# Altium project Remotev02.PrjPcb
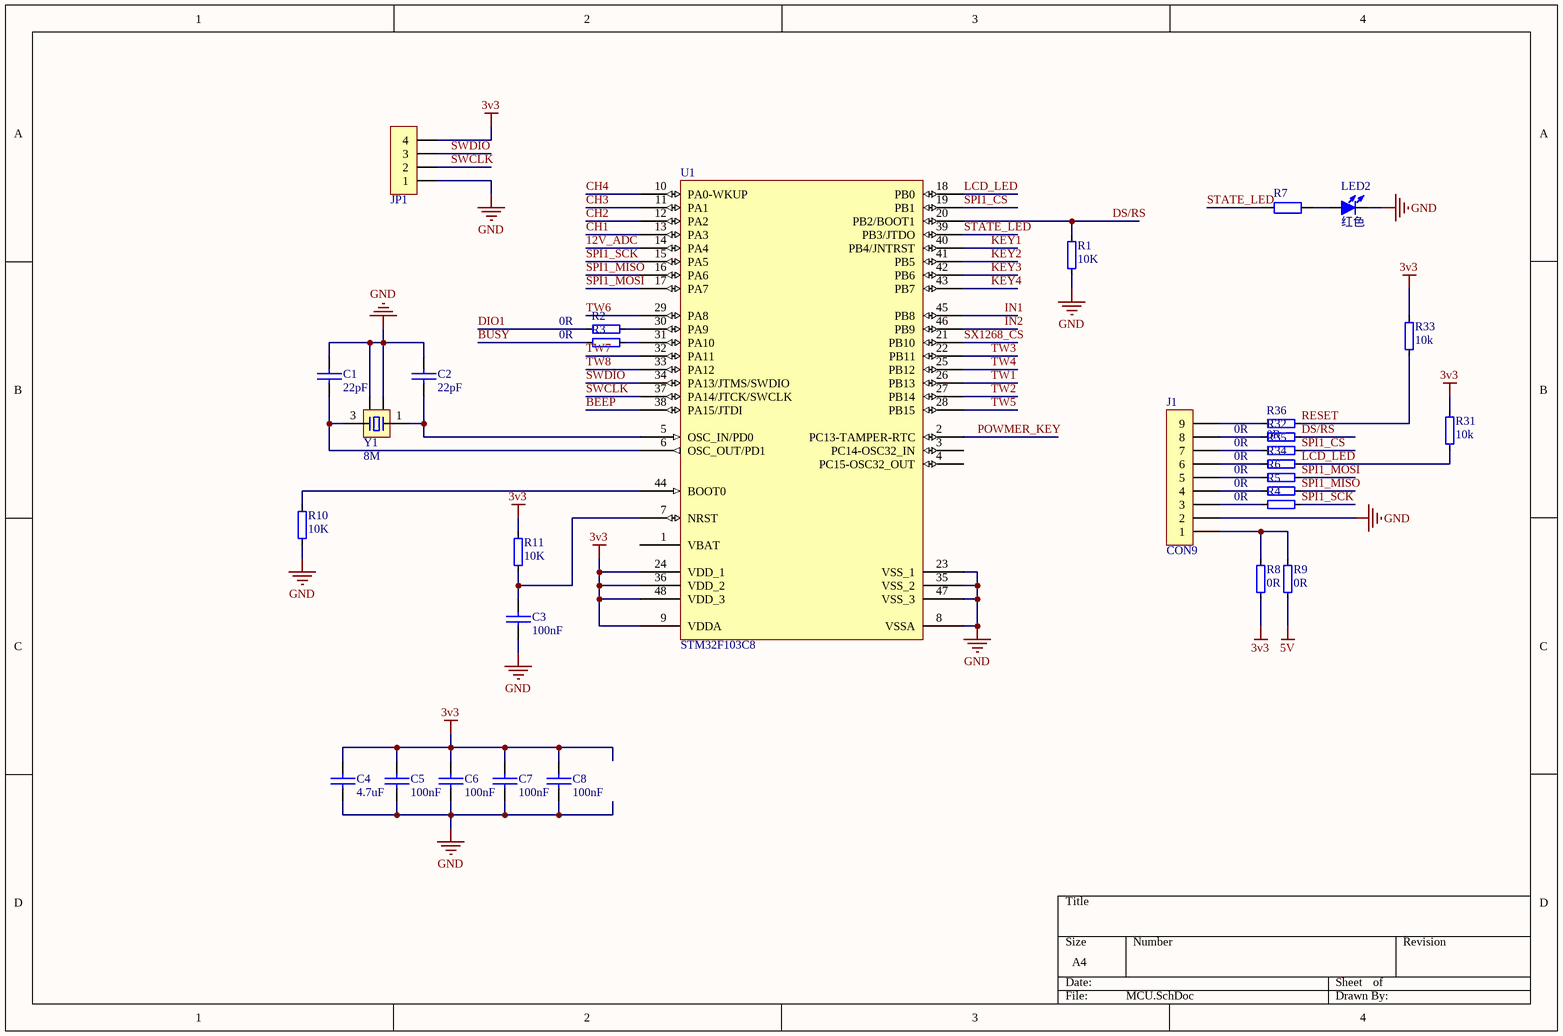
[diagram p0: MCU.SchDoc]
3 sheets, 116 parts. Net scope: global (net labels, ports and power ports of the same name join across sheets).
Board file: Remote.PcbDoc
Sheets:
  MCU.SchDoc
  INPUT.SchDoc
  COMMUNICATION.SchDoc

## Sheet MCU.SchDoc
size A4; SheetNumber: 1; SheetTotal: 4

### Parts
(Parts that share a designator on the sheet are numbered #1, #2 ... from top to bottom, then left to right.)
C1  22pF  [C 0603_L]
C2  22pF  [C 0603_L]
C3  100nF  [C 0603_L]
C4  4.7uF  [C 0603_L]
C5  100nF  [C 0603_L]
C6  100nF  [C 0603_L]
C7  100nF  [C 0603_L]
C8  100nF  [C 0603_L]
J1  CON9  [HDR2.54-Y-LI-9P]
JP1  HDR-1X4  [HDR2.54-LI-4P]  (value not drawn)
LED2  红色  [LED 0805G]
R1  10K  [R 0603_L]
R2  0R  [R 0603_L]
R3  0R  [R 0603_L]
R4  0R  [R 0603_L]
R5  0R  [R 0603_L]
R6  0R  [R 0603_L]
R7  (no value)  [R 0603_L]
R8  0R  [R 0603_L]
R9  0R  [R 0603_L]
R10  10K  [R 0603_L]
R11  10K  [R 0603_L]
R31  10k  [R 0603_L]
R32  0R  [R 0603_L]
R33  10k  [R 0603_L]
R34#1  0R  [R 0603_L]
R35#1  0R  [R 0603_L]
R36#1  0R  [R 0603_L]
U1  STM32F103C8  [LQFP-48_M]
Y1  8M  [OSC 3225-4P]

### Nets
3v3: C4.1 C5.1 C6.1 C7.1 C8.1 JP1.4 R8.2 R11.2 R31.1 R33.1 U1.9(VDDA) U1.24(VDD_1) U1.36(VDD_2) U1.48(VDD_3)
5V: R9.2
GND: C1.1 C2.1 C3.2 C4.2 C5.2 C6.2 C7.2 C8.2 J1.2 JP1.1 LED2.2(K) R1.2 R10.1 U1.8(VSSA) U1.23(VSS_1) U1.35(VSS_2) U1.47(VSS_3) Y1.2 Y1.4
12V_ADC: U1.14(PA4)
BEEP: U1.38(PA15/JTDI)
BUSY: R3.2
CH1: U1.13(PA3)
CH2: U1.12(PA2)
CH3: U1.11(PA1)
CH4: U1.10(PA0-WKUP)
DIO1: R2.2
DS/RS: R1.1 R32.1 U1.20(PB2/BOOT1)
IN1: U1.45(PB8)
IN2: U1.46(PB9)
KEY1: U1.40(PB4/JNTRST)
KEY2: U1.41(PB5)
KEY3: U1.42(PB6)
KEY4: U1.43(PB7)
LCD_LED: R31.2 R34#1.1 U1.18(PB0)
POWMER_KEY: U1.2(PC13-TAMPER-RTC)
RESET: R33.2 R36#1.2
SPI1_CS: R35#1.1 U1.19(PB1)
SPI1_MISO: R5.1 U1.16(PA6)
SPI1_MOSI: R6.1 U1.17(PA7)
SPI1_SCK: R4.1 U1.15(PA5)
STATE_LED: R7.1 U1.39(PB3/JTDO)
SWCLK: JP1.2 U1.37(PA14/JTCK/SWCLK)
SWDIO: JP1.3 U1.34(PA13/JTMS/SWDIO)
SX1268_CS: U1.21(PB10)
TW1: U1.26(PB13)
TW2: U1.27(PB14)
TW3: U1.22(PB11)
TW4: U1.25(PB12)
TW5: U1.28(PB15)
TW6: U1.29(PA8)
TW7: U1.32(PA11)
TW8: U1.33(PA12)
NetC1_2: C1.2 U1.6(OSC_OUT/PD1) Y1.3
NetC2_2: C2.2 U1.5(OSC_IN/PD0) Y1.1
NetC3_1: C3.1 R11.1 U1.7(NRST)
NetJ1_1: J1.1 R8.1 R9.1
NetJ1_3: J1.3 R4.2
NetJ1_4: J1.4 R5.2
NetJ1_5: J1.5 R6.2
NetJ1_6: J1.6 R34#1.2
NetJ1_7: J1.7 R35#1.2
NetJ1_8: J1.8 R32.2
NetJ1_9: J1.9 R36#1.1
NetLED2_1: LED2.1(A) R7.2
NetR2_1: R2.1 U1.30(PA9)
NetR3_1: R3.1 U1.31(PA10)
NetR10_2: R10.2 U1.44(BOOT0)

Not connected (* = marked no-connect by the designer): U1 1(VBAT) 3(PC14-OSC32_IN) 4(PC15-OSC32_OUT)

### Library data of the parts
C1-C8 = 普通电容: Capacitor
J1 = CON9: Connector
JP1 = Header 4: 4P接插件; 版权归属: 源创客; BOM名称: 4P接插件; 学习资源: www.ooocke.com
LED2 = LED-SMD: 贴片LED; 版权归属: 源创客; BOM名称: 贴片LED; 学习资源: www.ooocke.com
R1-R6 R8-R11 R31-R33 R34#1 R35#1 R36#1 = 普通电阻
R7 = R: 贴片电阻; 版权归属: 源创客; BOM名称: 贴片电阻; 学习资源: www.ooocke.com
U1 = STM32F103C8: Flaah:64/RAM:20/IO:36; BOM名称: 32位STM单片机; 版权归属: 源创客; 学习资源: www.ooocke.com
Y1 = XTAL-4P: 4脚无源晶振; 版权归属: 源创客; BOM名称: 4脚无源晶振; 学习资源: www.ooocke.com

## Sheet INPUT.SchDoc
size A4; SheetNumber: 2; SheetTotal: 4
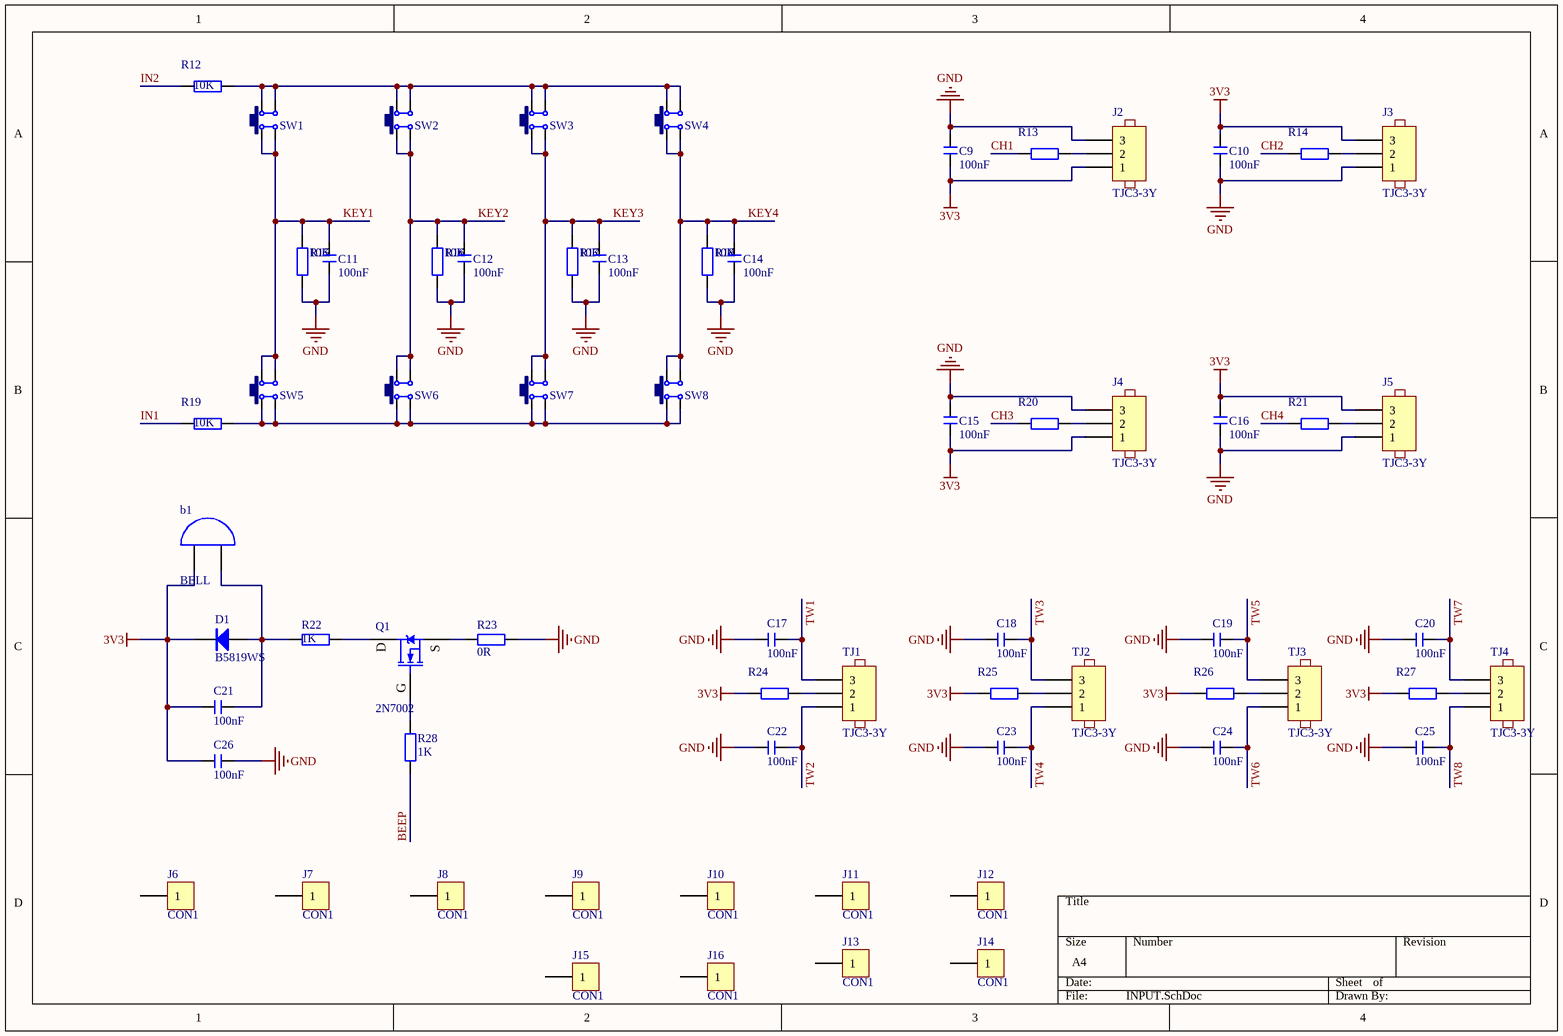
[diagram p1: INPUT.SchDoc]

### Parts
b1  BELL  [BEEP 5x9x5.5]
C9  100nF  [C 0603_L]
C10  100nF  [C 0603_L]
C11  100nF  [C 0603_L]
C12  100nF  [C 0603_L]
C13  100nF  [C 0603_L]
C14  100nF  [C 0603_L]
C15  100nF  [C 0603_L]
C16  100nF  [C 0603_L]
C17  100nF  [C 0603_L]
C18  100nF  [C 0603_L]
C19  100nF  [C 0603_L]
C20  100nF  [C 0603_L]
C21  100nF  [C 0603_L]
C22  100nF  [C 0603_L]
C23  100nF  [C 0603_L]
C24  100nF  [C 0603_L]
C25  100nF  [C 0603_L]
C26  100nF  [C 0603_L]
D1  B5819WS  [SOD-323]
J2  TJC3-3Y  [MX 1.25-LS-3P]
J3  TJC3-3Y  [MX 1.25-LS-3P]
J4  TJC3-3Y  [MX 1.25-LS-3P]
J5  TJC3-3Y  [MX 1.25-LS-3P]
J6  CON1  [M3x5+6_L]
J7  CON1  [M3x5+6_L]
J8  CON1  [M3x5+6_L]
J9  CON1  [M3x5+6_L]
J10  CON1  [M3x5+6_L]
J11  CON1  [M3x5+6_L]
J12  CON1  [M3x5+6_L]
J13  CON1  [M3x5+6_L]
J14  CON1  [M3x5+6_L]
J15  CON1  [M3x5+6_L]
J16  CON1  [M3x5+6_L]
Q1  2N7002  [SOT-23]
R12  10K  [R 0603_L]
R13  (no value)  [R 0603_L]
R14  (no value)  [R 0603_L]
R15  10K  [R 0603_L]
R16  10K  [R 0603_L]
R17  10K  [R 0603_L]
R18  10K  [R 0603_L]
R19  10K  [R 0603_L]
R20  (no value)  [R 0603_L]
R21  (no value)  [R 0603_L]
R22  1K  [R 0603_L]
R23  0R  [R 0603_L]
R24  (no value)  [R 0603_L]
R25  (no value)  [R 0603_L]
R26  (no value)  [R 0603_L]
R27  (no value)  [R 0603_L]
R28  1K  [R 0603_L]
SW1  6x6x5  [TSW SMD-6*6*5-L]  (value not drawn)
SW2  6x6x5  [TSW SMD-6*6*5-L]  (value not drawn)
SW3  6x6x5  [TSW SMD-6*6*5-L]  (value not drawn)
SW4  6x6x5  [TSW SMD-6*6*5-L]  (value not drawn)
SW5  6x6x5  [TSW SMD-6*6*5-L]  (value not drawn)
SW6  6x6x5  [TSW SMD-6*6*5-L]  (value not drawn)
SW7  6x6x5  [TSW SMD-6*6*5-L]  (value not drawn)
SW8  6x6x5  [TSW SMD-6*6*5-L]  (value not drawn)
TJ1  TJC3-3Y  [MX 1.25-LS-3P]
TJ2  TJC3-3Y  [MX 1.25-LS-3P]
TJ3  TJC3-3Y  [MX 1.25-LS-3P]
TJ4  TJC3-3Y  [MX 1.25-LS-3P]

### Nets
3v3: b1.1 C9.1 C10.2 C15.1 C16.2 C21.2 C26.2 D1.2(K) J2.1 J3.3 J4.1 J5.3 R24.2 R25.2 R26.2 R27.2
GND: C9.2 C10.1 C11.1 C12.1 C13.1 C14.1 C15.2 C16.1 C17.2 C18.2 C19.2 C20.2 C22.2 C23.2 C24.2 C25.2 C26.1 J2.3 J3.1 J4.3 J5.1 R15.2 R16.2 R17.2 R18.2 R23.1
BEEP: R28.1
CH1: R13.2
CH2: R14.2
CH3: R20.2
CH4: R21.2
IN1: R19.2
IN2: R12.2
KEY1: C11.2 R15.1 SW1.1 SW1.4 SW5.2 SW5.3
KEY2: C12.2 R16.1 SW2.1 SW2.4 SW6.2 SW6.3
KEY3: C13.2 R17.1 SW3.1 SW3.4 SW7.2 SW7.3
KEY4: C14.2 R18.1 SW4.1 SW4.4 SW8.2 SW8.3
TW1: C17.1 TJ1.3
TW2: C22.1 TJ1.1
TW3: C18.1 TJ2.3
TW4: C23.1 TJ2.1
TW5: C19.1 TJ3.3
TW6: C24.1 TJ3.1
TW7: C20.1 TJ4.3
TW8: C25.1 TJ4.1
Netb1_2: b1.2 C21.1 D1.1(A) R22.1
NetJ2_2: J2.2 R13.1
NetJ3_2: J3.2 R14.1
NetJ4_2: J4.2 R20.1
NetJ5_2: J5.2 R21.1
NetQ1_1: Q1.1(G) R28.2
NetQ1_2: Q1.2(D) R22.2
NetQ1_3: Q1.3(S) R23.2
NetR12_1: R12.1 SW1.2 SW1.3 SW2.2 SW2.3 SW3.2 SW3.3 SW4.2 SW4.3
NetR19_1: R19.1 SW5.1 SW5.4 SW6.1 SW6.4 SW7.1 SW7.4 SW8.1 SW8.4
NetR24_1: R24.1 TJ1.2
NetR25_1: R25.1 TJ2.2
NetR26_1: R26.1 TJ3.2
NetR27_1: R27.1 TJ4.2

Not connected (* = marked no-connect by the designer): J6 1; J7 1; J8 1; J9 1; J10 1; J11 1; J12 1; J13 1; J14 1; J15 1; J16 1

### Library data of the parts
C9-C26 = C: 无极性贴片电容; 版权归属: 源创客; BOM名称: 无极性贴片电容; 学习资源: www.ooocke.com
D1 = SR540: 肖特基二极管                           电压:40V 电流:1A                 C7420331; BOM名称: 整流二极管; 版权归属: 源创客; 属性: 40V  5A; 学习资源: www.ooocke.com
J2-J5 TJ1-TJ4 = TJC3-3Y: HCZZ0015-3             C7433469; Set Position: 0.5; Published: 8-Jun-2000; LatestRevisionDate: 17-Jul-2002; LatestRevisionNote: Re-released for DXP Platform.; PackageReference: AXIAL-0.6; Publisher: Altium Limited
Q1 = IRF840: N沟场效应管; pin to pad: 2>3 3>2; 版权归属: 源创客; BOM名称: N沟场效应管; 学习资源: www.ooocke.com
R12-R28 = R: 贴片电阻; 版权归属: 源创客; BOM名称: 贴片电阻; 学习资源: www.ooocke.com
SW1-SW8 = TSW SMD-6x6: KH-6X6X5H-STM     C2837531; pin to pad: 3>0 4>0; BOM名称: 贴片6x6轻触开关; 版权归属: 源创客; 学习资源: www.ooocke.com

## Sheet COMMUNICATION.SchDoc
size A4; SheetNumber: 3; SheetTotal: 4
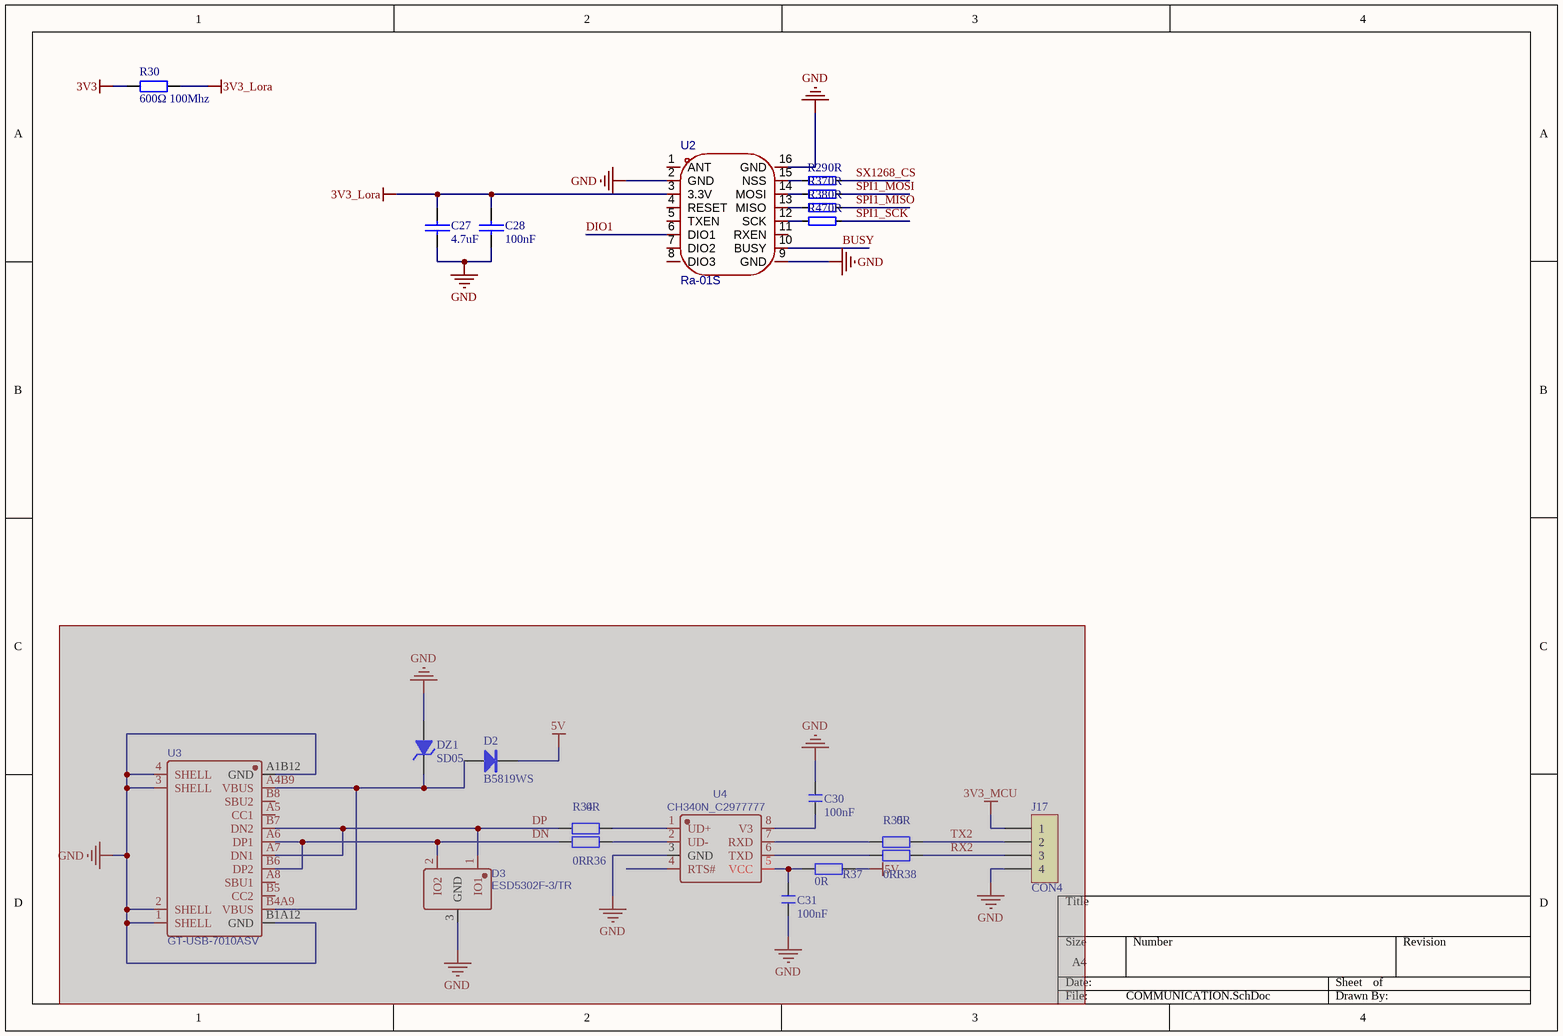
[diagram p2: COMMUNICATION.SchDoc]

### Parts
(Parts that share a designator on the sheet are numbered #1, #2 ... from top to bottom, then left to right.)
C27  4.7uF  [C 0805_L]
C28  100nF  [C 0603_L]
C30  100nF  [C 0603_L]  (masked out: inside a compile mask, not in the netlist)
C31  100nF  [C 0603_L]  (masked out: inside a compile mask, not in the netlist)
D2  B5819WS  [SOD-323]  (masked out: inside a compile mask, not in the netlist)
D3  ESD5302F-3/TR  [SOT-23]  (masked out: inside a compile mask, not in the netlist)
DZ1  SD05  [SOD-323]  (masked out: inside a compile mask, not in the netlist)
J17  CON4  [HDR2.54-LI-4P]  (masked out: inside a compile mask, not in the netlist)
R29  0R  [R 0603_L]
R30  600Ω 100Mhz  [R 0805_L]
R34#2  0R  [R 0603_L]  (masked out: inside a compile mask, not in the netlist)
R35#2  0R  [R 0603_L]  (masked out: inside a compile mask, not in the netlist)
R36#2  0R  [R 0603_L]  (masked out: inside a compile mask, not in the netlist)
R37#1  0R  [R 0603_L]
R37#2  0R  [R 0603_L]  (masked out: inside a compile mask, not in the netlist)
R38#1  0R  [R 0603_L]
R38#2  0R  [R 0603_L]  (masked out: inside a compile mask, not in the netlist)
R47  0R  [R 0603_L]
U2  Ra-01S  [RA-01SCH-P-TJFZ]
U3  GT-USB-7010ASV  [USB-C-SMD_G-SWITCH_GT-USB-7010ASV]  (masked out: inside a compile mask, not in the netlist)
U4  CH340N_C2977777  [SOP8]  (masked out: inside a compile mask, not in the netlist)

### Nets
3v3: R30.1
3V3_Lora: C27.1 C28.1 R30.2 U2.3(3.3V)
GND: C27.2 C28.2 U2.2(GND) U2.9(GND) U2.16(GND)
BUSY: U2.10(BUSY)
DIO1: U2.6(DIO1)
SPI1_MISO: R38#1.1
SPI1_MOSI: R37#1.1
SPI1_SCK: R47.1
SX1268_CS: R29.1
NetR29_2: R29.2 U2.15(NSS)
NetR37#1_2: R37#1.2 U2.14(MOSI)
NetR38#1_2: R38#1.2 U2.13(MISO)
NetR47_2: R47.2 U2.12(SCK)

Not connected (* = marked no-connect by the designer): U2 1(ANT) 4(RESET) 5(TXEN) 7(DIO2) 8(DIO3) 11(RXEN)

### Library data of the parts
C27 C28 = 普通电容: Capacitor
C30 C31 = C: 无极性贴片电容; 版权归属: 源创客; BOM名称: 无极性贴片电容; 学习资源: www.ooocke.com
D2 = SR540: as D1 on sheet INPUT; 学习资源: www.ooocke.com
D3 = ESD5302F-3/TR: 单向TVS 5V截止 峰值浪涌电流：4A@8/20us                        C239643; Manufacturer: WILLSEMI(韦尔); Contributor: LCSC; Supplier: LCSC; Supplier Part: C239643; Manufacturer Part: ESD5302F-3/TR; JLCPCB Part Class: Extended Part; spicePre: D; spiceSymbolName: ESD5302F-3/TR
DZ1 = 1N4106: 单向TVS 5V截止 峰值脉冲电流：17A              C502527; BOM名称: 12V/0.5W稳压管; 版权归属: 源创客; 学习资源: www.ooocke.com
J17 = CON4: Connector
R29 R37#1 R38#1 R47 = 普通电阻
R30 = R: 磁珠; BOM名称: 贴片电阻; 版权归属: 源创客; 学习资源: www.ooocke.com
R34#2 R35#2 R36#2 R37#2 R38#2 = R: 贴片电阻; 版权归属: 源创客; BOM名称: 贴片电阻; 学习资源: www.ooocke.com
U2 = Ra-01S: 发射功率:22dBm;接口类型:SPI;接收灵敏度:-140dBm;; Manufacturer: Ai-Thinker(安信可); AddInBom: yes; ModelId: bfb9ea955ff445c193018999188b6f80聨0819f05c4eef4c71ace90d822a990e87; ModelName: COMM-SMD_L17.0-W16.0-H3.2-RA-01S; ModelTransform: 629.92,669.29,0,0,0,0,0.001,0,0; Output Power: 22dBm; Interface Type: SPI; Modulation System: LoRa；OOK；MSK；GFSK；FSK；GMSK; Voltage - Supply: 3.3V; Antenna Type: IPEX接口; Receive  Current: 4.5mA; Send  Current: 140mA; Symbol: RA-01S; Device: Ra-01S; LCSC Part Name: 两件套 LoRa 系列模块 两件套; SupplierPart: C724871; ManufacturerPart: Ra-01S; Supplier Footprint: SMD,17x16mm; JLCPCB Part Class: Extended Part; Datasheet: https://item.szlcsc.com/datasheet/Ra-01S/770920.html; Supplier: LCSC; ConvertToPcb: yes; FootprintName: COMM-SMD_RA-01S; Sensitivity: -140dBm; Operating Temperature: -40℃~+85℃
U3 = GT-USB-7010ASV: Type-C 母 卧贴                板上16pin，有柱无弹，L7.35 CH1.68mm，3A电流                         C2988369; Manufacturer: G-Switch(品赞); Contributor: lcsc; Supplier: LCSC; Supplier Part: C2988369; Manufacturer Part: GT-USB-7010ASV; JLCPCB Part Class: Extended Part; spicePre: U; spiceSymbolName: GT-USB-7010ASV
U4 = CH340N_C2977777: Manufacturer: WCH(南京沁恒); Manufacturer Part: CH340N; Contributor: LCSC; Supplier: LCSC; Supplier Part: C2977777; JLCPCB Part Class: Extended Part; spicePre: U; spiceSymbolName: CH340N_C2977777

## Nets that join several sheets
3v3: MCU (14 pins), INPUT (16 pins), COMMUNICATION (R30.1)
GND: MCU (19 pins), INPUT (26 pins), COMMUNICATION (5 pins)
BEEP: MCU (U1.38), INPUT (R28.1)
BUSY: MCU (R3.2), COMMUNICATION (U2.10)
CH1: MCU (U1.13), INPUT (R13.2)
CH2: MCU (U1.12), INPUT (R14.2)
CH3: MCU (U1.11), INPUT (R20.2)
CH4: MCU (U1.10), INPUT (R21.2)
DIO1: MCU (R2.2), COMMUNICATION (U2.6)
IN1: MCU (U1.45), INPUT (R19.2)
IN2: MCU (U1.46), INPUT (R12.2)
KEY1: MCU (U1.40), INPUT (6 pins)
KEY2: MCU (U1.41), INPUT (6 pins)
KEY3: MCU (U1.42), INPUT (6 pins)
KEY4: MCU (U1.43), INPUT (6 pins)
SPI1_MISO: MCU (R5.1 U1.16), COMMUNICATION (R38#1.1)
SPI1_MOSI: MCU (R6.1 U1.17), COMMUNICATION (R37#1.1)
SPI1_SCK: MCU (R4.1 U1.15), COMMUNICATION (R47.1)
SX1268_CS: MCU (U1.21), COMMUNICATION (R29.1)
TW1: MCU (U1.26), INPUT (C17.1 TJ1.3)
TW2: MCU (U1.27), INPUT (C22.1 TJ1.1)
TW3: MCU (U1.22), INPUT (C18.1 TJ2.3)
TW4: MCU (U1.25), INPUT (C23.1 TJ2.1)
TW5: MCU (U1.28), INPUT (C19.1 TJ3.3)
TW6: MCU (U1.29), INPUT (C24.1 TJ3.1)
TW7: MCU (U1.32), INPUT (C20.1 TJ4.3)
TW8: MCU (U1.33), INPUT (C25.1 TJ4.1)